# Altium schematic sheet MOSFETs.SchDoc
size A4
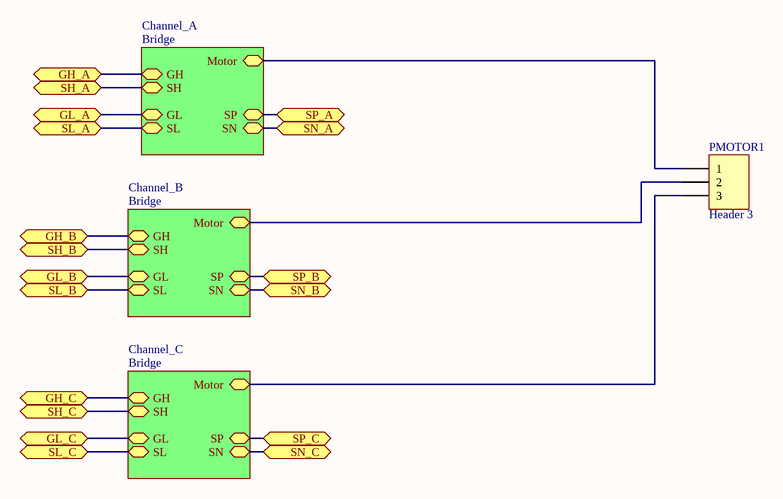
[diagram p0: MOSFETs.SchDoc]

## Parts
PMOTOR1  Header 3  [HDR1X3]

## Sub-sheets
Channel_A = Bridge: GH, SH, SL, Motor, SN, SP, GL
Channel_B = Bridge: GH, SH, SL, Motor, SN, SP, GL
Channel_C = Bridge: GH, SH, SL, Motor, SN, SP, GL

## Ports
GH_A, GH_B, GH_C, GL_A, GL_B, GL_C, SH_A, SH_B, SH_C, SL_A, SL_B, SL_C, SN_A, SN_B, SN_C, SP_A, SP_B, SP_C

## Nets
GH_A: port GH_A, sheet Channel_A/GH
GH_B: port GH_B, sheet Channel_B/GH
GH_C: port GH_C, sheet Channel_C/GH
GL_A: port GL_A, sheet Channel_A/GL
GL_B: port GL_B, sheet Channel_B/GL
GL_C: port GL_C, sheet Channel_C/GL
SH_A: port SH_A, sheet Channel_A/SH
SH_B: port SH_B, sheet Channel_B/SH
SH_C: port SH_C, sheet Channel_C/SH
SL_A: port SL_A, sheet Channel_A/SL
SL_B: port SL_B, sheet Channel_B/SL
SL_C: port SL_C, sheet Channel_C/SL
SN_A: port SN_A, sheet Channel_A/SN
SN_B: port SN_B, sheet Channel_B/SN
SN_C: port SN_C, sheet Channel_C/SN
SP_A: port SP_A, sheet Channel_A/SP
SP_B: port SP_B, sheet Channel_B/SP
SP_C: port SP_C, sheet Channel_C/SP
NetPMOTOR1_1: PMOTOR1.1 ; sheet Channel_A/Motor
NetPMOTOR1_2: PMOTOR1.2 ; sheet Channel_B/Motor
NetPMOTOR1_3: PMOTOR1.3 ; sheet Channel_C/Motor

## Library data of the parts
PMOTOR1 = Header 3: Header, 3-Pin; LatestRevisionDate: 17-Jul-2002; LatestRevisionNote: Re-released for DXP Platform.; Publisher: Altium Limited